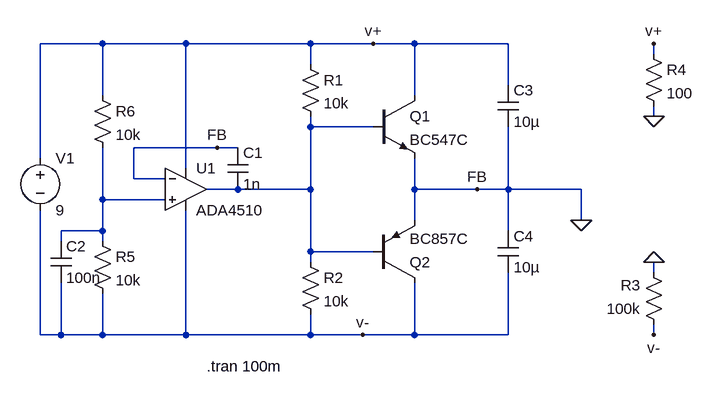
[diagram p0: schematic SplitRail.asc]
SplitRail.asc, the LTspice schematic file:
Version 4
SHEET 1 1184 680
WIRE -224 -64 -320 -64
WIRE -96 -64 -224 -64
WIRE 96 -64 -96 -64
WIRE 192 -64 96 -64
WIRE 256 -64 192 -64
WIRE 400 -64 256 -64
WIRE 624 -48 624 -64
WIRE 96 -32 96 -64
WIRE 400 0 400 -64
WIRE -224 16 -224 -64
WIRE 256 16 256 -64
WIRE 624 48 624 32
WIRE 96 64 96 48
WIRE 192 64 96 64
WIRE -48 96 -176 96
WIRE -16 96 -48 96
WIRE -320 112 -320 -64
WIRE -96 128 -96 -64
WIRE -176 144 -176 96
WIRE -128 144 -176 144
WIRE -16 160 -64 160
WIRE 96 160 96 64
WIRE 96 160 -16 160
WIRE 256 160 256 112
WIRE 352 160 256 160
WIRE 400 160 400 64
WIRE 400 160 352 160
WIRE 512 160 400 160
WIRE -224 176 -224 96
WIRE -128 176 -224 176
WIRE 256 208 256 160
WIRE 512 208 512 160
WIRE -224 224 -224 176
WIRE -224 224 -288 224
WIRE 400 224 400 160
WIRE -288 240 -288 224
WIRE -224 240 -224 224
WIRE 96 256 96 160
WIRE 192 256 96 256
WIRE 96 272 96 256
WIRE 624 288 624 272
WIRE -320 384 -320 192
WIRE -288 384 -288 304
WIRE -288 384 -320 384
WIRE -224 384 -224 320
WIRE -224 384 -288 384
WIRE -96 384 -96 192
WIRE -96 384 -224 384
WIRE 96 384 96 352
WIRE 96 384 -96 384
WIRE 176 384 96 384
WIRE 256 384 256 304
WIRE 256 384 176 384
WIRE 400 384 400 288
WIRE 400 384 256 384
WIRE 624 384 624 368
FLAG 512 208 0
FLAG 192 -64 v+
FLAG 176 384 v-
FLAG 624 -64 v+
FLAG 624 384 v-
FLAG 624 48 0
FLAG 624 272 0
FLAG -48 96 FB
FLAG 352 160 FB
SYMBOL voltage -320 96 R0
WINDOW 123 0 0 Left 0
WINDOW 39 0 0 Left 0
SYMATTR InstName V1
SYMATTR Value 9
SYMBOL res 80 -48 R0
SYMATTR InstName R1
SYMATTR Value 10k
SYMBOL res 80 256 R0
SYMATTR InstName R2
SYMATTR Value 10k
SYMBOL npn 192 16 R0
SYMATTR InstName Q1
SYMATTR Value BC547C
SYMBOL pnp 192 304 M180
SYMATTR InstName Q2
SYMATTR Value BC857C
SYMBOL res 640 384 R180
WINDOW 0 36 76 Left 2
WINDOW 3 36 40 Left 2
SYMATTR InstName R3
SYMATTR Value 100k
SYMBOL res 608 -64 R0
SYMATTR InstName R4
SYMATTR Value 100
SYMBOL OpAmps\\ADA4510 -96 96 R0
SYMATTR InstName U1
SYMBOL cap -32 96 R0
SYMATTR InstName C1
SYMATTR Value 1n
SYMBOL res -240 224 R0
SYMATTR InstName R5
SYMATTR Value 10k
SYMBOL res -240 0 R0
SYMATTR InstName R6
SYMATTR Value 10k
SYMBOL cap -304 240 R0
SYMATTR InstName C2
SYMATTR Value 100n
SYMBOL cap 384 0 R0
SYMATTR InstName C3
SYMATTR Value 10µ
SYMBOL cap 384 224 R0
SYMATTR InstName C4
SYMATTR Value 10µ
TEXT -64 432 Left 2 !.tran 100m

The netlist it stands for:
* SplitRail.asc
V1 v+ v- 9
R1 v+ N001 10k
R2 N001 v- 10k
Q1 v+ N001 0 0 BC547C
Q2 v- N001 0 0 BC857C
R3 v- 0 100k
R4 v+ 0 100
XU1 N002 0 v+ v- N001 ADA4510  ; pins In+ In- V+ V- OUT
C1 0 N001 1n
R5 N002 v- 10k
R6 v+ N002 10k
C2 N002 v- 100n
C3 v+ 0 10µ
C4 0 v- 10µ
.model NPN NPN
.model PNP PNP
.lib standard.bjt
.tran 100m
.backanno
.end